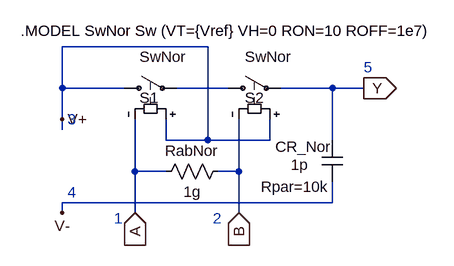
[diagram p0: schematic NorH.asc]
NorH.asc, the LTspice schematic file:
Version 4
SHEET 1 880 680
WIRE -112 224 -112 160
WIRE -112 272 -112 224
WIRE -112 288 -112 272
WIRE -112 416 -112 400
WIRE -16 224 -112 224
WIRE 0 352 0 272
WIRE 0 416 0 352
WIRE 48 304 48 272
WIRE 48 352 0 352
WIRE 112 160 -112 160
WIRE 112 304 48 304
WIRE 112 304 112 160
WIRE 144 224 64 224
WIRE 160 352 128 352
WIRE 160 352 160 272
WIRE 160 416 160 352
WIRE 208 304 112 304
WIRE 208 304 208 272
WIRE 304 224 224 224
WIRE 304 304 304 224
WIRE 304 400 -112 400
WIRE 304 400 304 368
WIRE 352 224 304 224
FLAG 352 224 Y
IOPIN 352 224 Out
FLAG 0 416 A
IOPIN 0 416 In
FLAG 160 416 B
IOPIN 160 416 In
FLAG -112 416 V-
FLAG -112 272 V+
SYMBOL sw -32 224 R270
WINDOW 0 -15 39 VRight 0
WINDOW 3 48 39 VRight 0
SYMATTR InstName S1
SYMATTR Value SwNor
SYMBOL sw 128 224 R270
WINDOW 0 -15 41 VRight 0
WINDOW 3 48 41 VRight 0
SYMATTR InstName S2
SYMATTR Value SwNor
SYMBOL res 144 336 R90
WINDOW 0 0 56 VBottom 0
WINDOW 3 32 56 VTop 0
SYMATTR InstName RabNor
SYMATTR Value 1g
SYMBOL cap 288 304 R0
WINDOW 0 -72 10 Left 0
WINDOW 3 -48 38 Left 0
WINDOW 39 -94 72 Left 0
SYMATTR InstName CR_Nor
SYMATTR Value 1p
SYMATTR SpiceLine Rpar=10k
TEXT -32 424 Left 0 ;1
TEXT 120 424 Left 0 ;2
TEXT 352 192 Left 0 ;5
TEXT -176 136 Left 0 !.MODEL SwNor Sw (VT={Vref} VH=0 RON=10 ROFF=1e7)
TEXT -104 272 Left 0 ;3
TEXT -104 384 Left 0 ;4

The netlist it stands for:
* NorH.asc
S1 V+ N001 V+ A SwNor
S2 N001 Y V+ B SwNor
RabNor B A 1g
CR_Nor Y V- 1p Rpar=10k
* 1
* 2
* 5
.MODEL SwNor Sw (VT={Vref} VH=0 RON=10 ROFF=1e7)
* 3
* 4
.backanno
.end